# Altium schematic sheet LedDriver.SchDoc
size A4; PageSetup: Record=PageOptions|CenterHorizontal=True|CenterVertical=True|PrintScale=1.05|XCorrection=1.00|YCorrection=1.00|PrintKind=1|BorderSize=5000000|LeftOffset=0|BottomOffset=0|Orientation=2|PaperLength=1000|PaperWidth=1000|Scale=100|PaperSource=7|PrintQuality=-3|MediaType=1|DitherType=10|PrintScaleMode=1|PaperKind=A4|PaperIndex=9
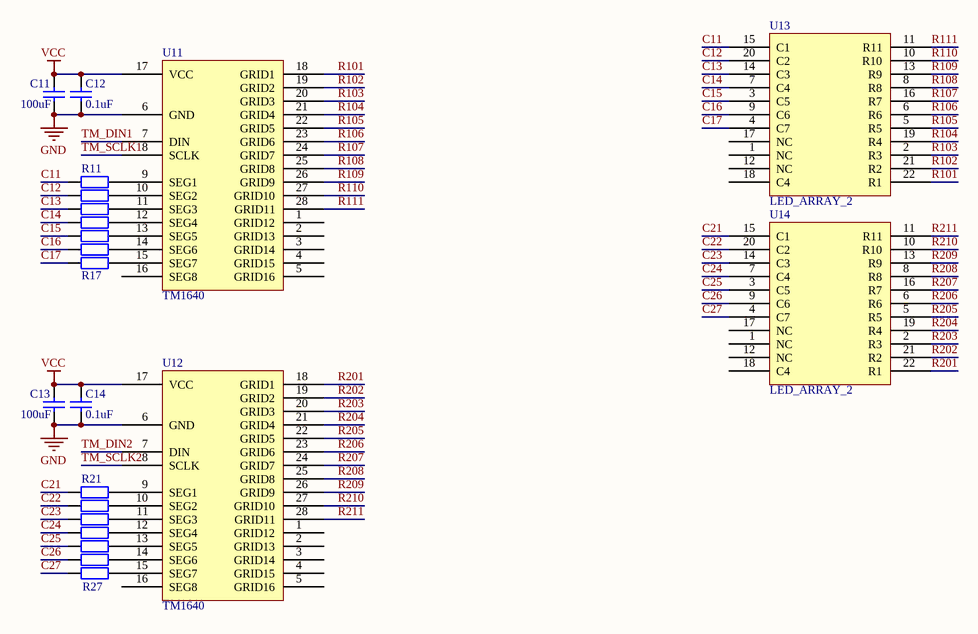
[diagram p0: LedDriver.SchDoc]

## Parts
C11  value 100uF  [CAP-3528]  (hidden comment: Cap)
C12  value 0.1uF  [C-0805]  (hidden comment: Cap)
C13  value 100uF  [CAP-3528]  (hidden comment: Cap)
C14  value 0.1uF  [C-0805]  (hidden comment: Cap)
R11  Res2  [0805-1]  (value not drawn)
R12  Res2  [0805-1]  (value not drawn)
R13  Res2  [0805-1]  (value not drawn)
R14  Res2  [0805-1]  (value not drawn)
R15  Res2  [0805-1]  (value not drawn)
R16  Res2  [0805-1]  (value not drawn)
R17  Res2  [0805-1]  (value not drawn)
R21  Res2  [0805-1]  (value not drawn)
R22  Res2  [0805-1]  (value not drawn)
R23  Res2  [0805-1]  (value not drawn)
R24  Res2  [0805-1]  (value not drawn)
R25  Res2  [0805-1]  (value not drawn)
R26  Res2  [0805-1]  (value not drawn)
R27  Res2  [0805-1]  (value not drawn)
U11  TM1640  [SOIC28W]
U12  TM1640  [SOIC28W]
U13  LED_ARRAY_2  [DIP22_LEDARR]
U14  LED_ARRAY_2  [DIP22_LEDARR]

## Nets
GND: C11.1 C12.1 C13.1 C14.1 U11.6(GND) U12.6(GND)
VCC: C11.2 C12.2 C13.2 C14.2 U11.17(VCC) U12.17(VCC)
C11: R11.1 U13.15(C1)
C12: R12.1 U13.20(C2)
C13: R13.1 U13.14(C3)
C14: R14.1 U13.7(C4)
C15: R15.1 U13.3(C5)
C16: R16.1 U13.9(C6)
C17: R17.1 U13.4(C7)
C21: R21.1 U14.15(C1)
C22: R22.1 U14.20(C2)
C23: R23.1 U14.14(C3)
C24: R24.1 U14.7(C4)
C25: R25.1 U14.3(C5)
C26: R26.1 U14.9(C6)
C27: R27.1 U14.4(C7)
R101: U11.18(GRID1) U13.22(R1)
R102: U11.19(GRID2) U13.21(R2)
R103: U11.20(GRID3) U13.2(R3)
R104: U11.21(GRID4) U13.19(R4)
R105: U11.22(GRID5) U13.5(R5)
R106: U11.23(GRID6) U13.6(R6)
R107: U11.24(GRID7) U13.16(R7)
R108: U11.25(GRID8) U13.8(R8)
R109: U11.26(GRID9) U13.13(R9)
R110: U11.27(GRID10) U13.10(R10)
R111: U11.28(GRID11) U13.11(R11)
R201: U12.18(GRID1) U14.22(R1)
R202: U12.19(GRID2) U14.21(R2)
R203: U12.20(GRID3) U14.2(R3)
R204: U12.21(GRID4) U14.19(R4)
R205: U12.22(GRID5) U14.5(R5)
R206: U12.23(GRID6) U14.6(R6)
R207: U12.24(GRID7) U14.16(R7)
R208: U12.25(GRID8) U14.8(R8)
R209: U12.26(GRID9) U14.13(R9)
R210: U12.27(GRID10) U14.10(R10)
R211: U12.28(GRID11) U14.11(R11)
TM_DIN1: U11.7(DIN)
TM_DIN2: U12.7(DIN)
TM_SCLK1: U11.8(SCLK)
TM_SCLK2: U12.8(SCLK)
NetR11_2: R11.2 U11.9(SEG1)
NetR12_2: R12.2 U11.10(SEG2)
NetR13_2: R13.2 U11.11(SEG3)
NetR14_2: R14.2 U11.12(SEG4)
NetR15_2: R15.2 U11.13(SEG5)
NetR16_2: R16.2 U11.14(SEG6)
NetR17_2: R17.2 U11.15(SEG7)
NetR21_2: R21.2 U12.9(SEG1)
NetR22_2: R22.2 U12.10(SEG2)
NetR23_2: R23.2 U12.11(SEG3)
NetR24_2: R24.2 U12.12(SEG4)
NetR25_2: R25.2 U12.13(SEG5)
NetR26_2: R26.2 U12.14(SEG6)
NetR27_2: R27.2 U12.15(SEG7)

Not connected (* = marked no-connect by the designer): U11 1(GRID12) 2(GRID13) 3(GRID14) 4(GRID15) 5(GRID16) 16(SEG8); U12 1(GRID12) 2(GRID13) 3(GRID14) 4(GRID15) 5(GRID16) 16(SEG8); U13 1(NC) 12(NC) 17(NC) 18(C4); U14 1(NC) 12(NC) 17(NC) 18(C4)

## Library data of the parts
C11-C14 = Cap: Capacitor; Published: 8-Jun-2000; LatestRevisionDate: 17-Jul-2002; LatestRevisionNote: Re-released for DXP Platform.; PackageReference: RAD-0.3; Publisher: Altium Limited; PackageDescription: Radial Cap, Thru-Hole; 2 Leads; 0.3 in Pin Spacing
R11-R17 R21-R27 = Res2: Resistor; Value: 1K; Published: 8-Jun-2000; LatestRevisionDate: 17-Jul-2002; LatestRevisionNote: Re-released for DXP Platform.; PackageReference: AXIAL-0.4; Publisher: Altium Limited; PackageDescription: Axial Device, Thru-Hole; 2 Leads; 0.4 in Pin Spacing
U11 U12 = TM1640: 8 段×16 位LED驱动芯片